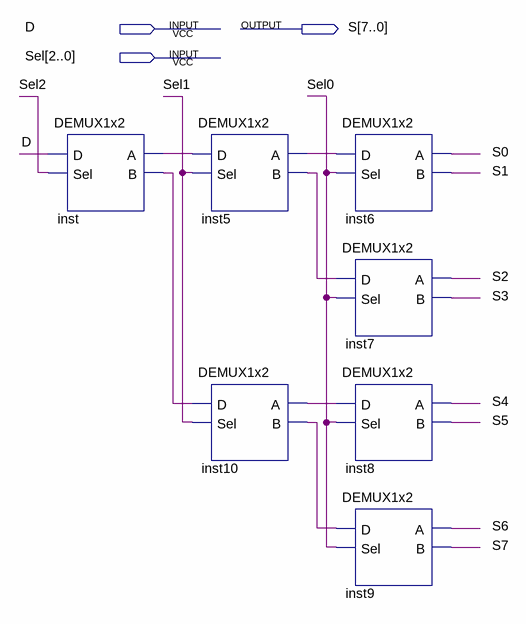
[diagram p0: schematic sheet]
// Quartus schematic DEMUX1x8.bdf as structural Verilog: 7 symbols, 3 pins
module DEMUX1x8 (
  input  D,
  input  [2:0] Sel,
  output [7:0] S
);

  wire inst5_a, inst5_b, inst10_a, inst10_b, inst_a, inst_b;

  DEMUX1x2 inst (.D(D), .Sel(Sel[2]), .A(inst_a), .B(inst_b));
  DEMUX1x2 inst5 (.D(inst_a), .Sel(Sel[1]), .A(inst5_a), .B(inst5_b));
  DEMUX1x2 inst10 (.D(inst_b), .Sel(Sel[1]), .A(inst10_a), .B(inst10_b));
  DEMUX1x2 inst6 (.D(inst5_a), .Sel(Sel[0]), .A(S[0]), .B(S[1]));
  DEMUX1x2 inst7 (.D(inst5_b), .Sel(Sel[0]), .A(S[2]), .B(S[3]));
  DEMUX1x2 inst8 (.D(inst10_a), .Sel(Sel[0]), .A(S[4]), .B(S[5]));
  DEMUX1x2 inst9 (.D(inst10_b), .Sel(Sel[0]), .A(S[6]), .B(S[7]));
endmodule
